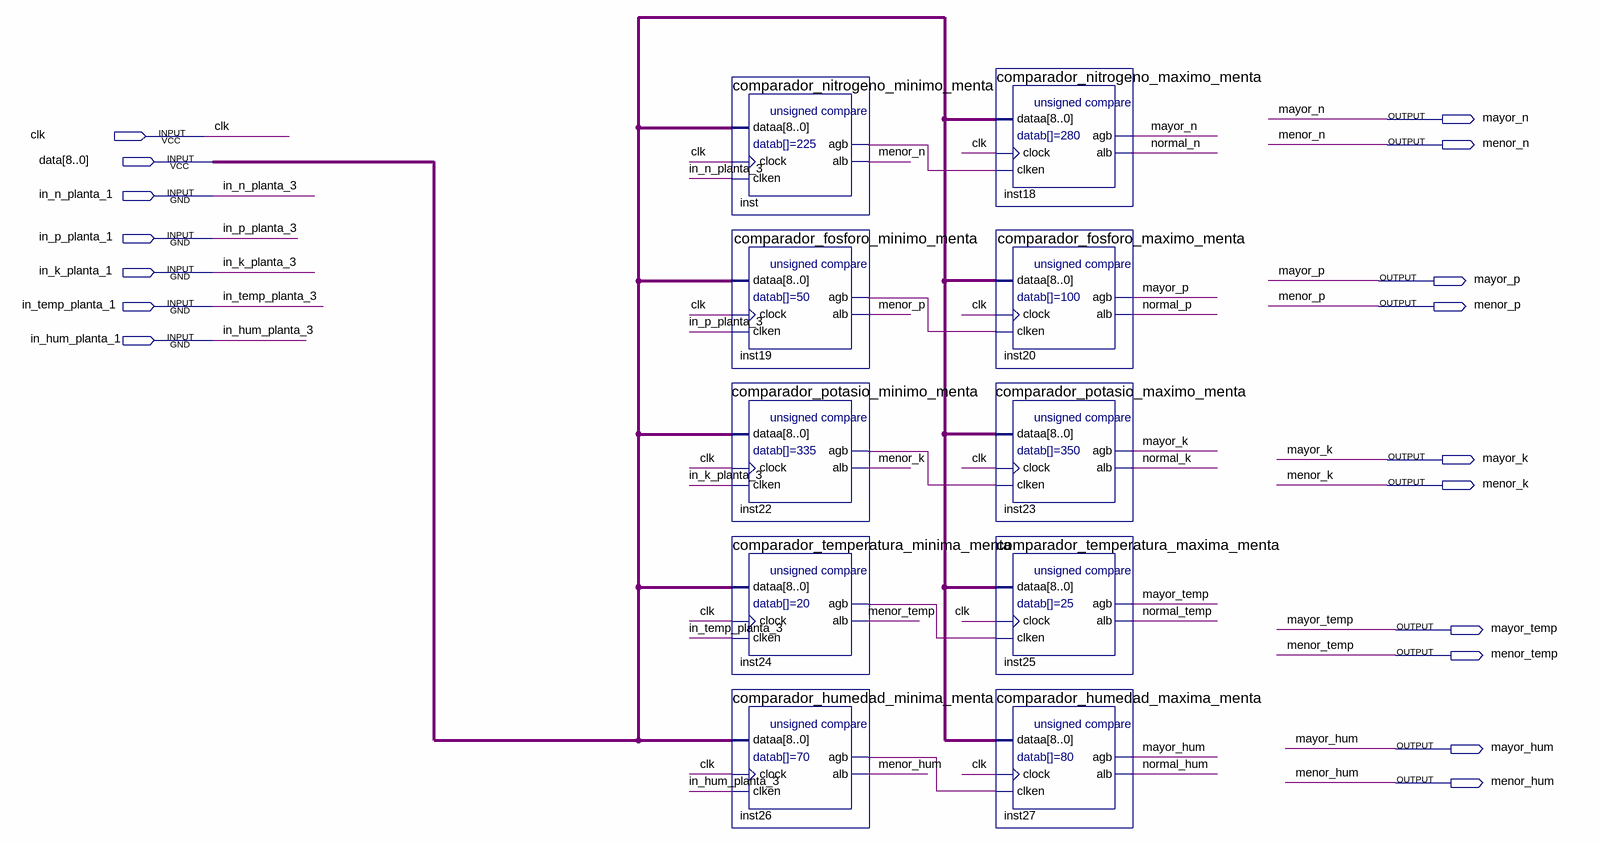
[diagram p0: schematic sheet]
// Quartus schematic Comparador_planta_1.bdf as structural Verilog: 10 symbols, 17 pins
module Comparador_planta_1 (
  input  clk,
  input  [8:0] data,
  input  in_n_planta_1,
  input  in_p_planta_1,
  input  in_k_planta_1,
  input  in_temp_planta_1,
  input  in_hum_planta_1,
  output mayor_n,
  output menor_n,
  output mayor_p,
  output menor_p,
  output mayor_k,
  output menor_k,
  output mayor_temp,
  output menor_temp,
  output mayor_hum,
  output menor_hum
);

  wire inst19_agb, inst22_agb, inst24_agb, inst26_agb, inst_agb, normal_hum, normal_k, normal_n, normal_p,
       normal_temp;

  comparador_nitrogeno_minimo_menta inst (
    .dataa(data), .clock(clk), .clken(in_n_planta_1), .agb(inst_agb), .alb(menor_n));
  comparador_fosforo_minimo_menta inst19 (
    .dataa(data), .clock(clk), .clken(in_p_planta_1), .agb(inst19_agb), .alb(menor_p));
  comparador_potasio_minimo_menta inst22 (
    .dataa(data), .clock(clk), .clken(in_k_planta_1), .agb(inst22_agb), .alb(menor_k));
  comparador_temperatura_minima_menta inst24 (
    .dataa(data), .clock(clk), .clken(in_temp_planta_1), .agb(inst24_agb), .alb(menor_temp));
  comparador_humedad_minima_menta inst26 (
    .dataa(data), .clock(clk), .clken(in_hum_planta_1), .agb(inst26_agb), .alb(menor_hum));
  comparador_nitrogeno_maximo_menta inst18 (.dataa(data), .clock(clk), .clken(inst_agb), .agb(mayor_n), .alb(normal_n));
  comparador_fosforo_maximo_menta inst20 (.dataa(data), .clock(clk), .clken(inst19_agb), .agb(mayor_p), .alb(normal_p));
  comparador_potasio_maximo_menta inst23 (.dataa(data), .clock(clk), .clken(inst22_agb), .agb(mayor_k), .alb(normal_k));
  comparador_temperatura_maxima_menta inst25 (
    .dataa(data), .clock(clk), .clken(inst24_agb), .agb(mayor_temp), .alb(normal_temp));
  comparador_humedad_maxima_menta inst27 (
    .dataa(data), .clock(clk), .clken(inst26_agb), .agb(mayor_hum), .alb(normal_hum));

  // Other names for the same wires on the sheet: in_hum_planta_3 = in_hum_planta_1; in_k_planta_3 = in_k_planta_1;
  //   in_n_planta_3 = in_n_planta_1; in_p_planta_3 = in_p_planta_1; in_temp_planta_3 = in_temp_planta_1
endmodule
